# Altium project DAQ_REV_B.PrjPcb
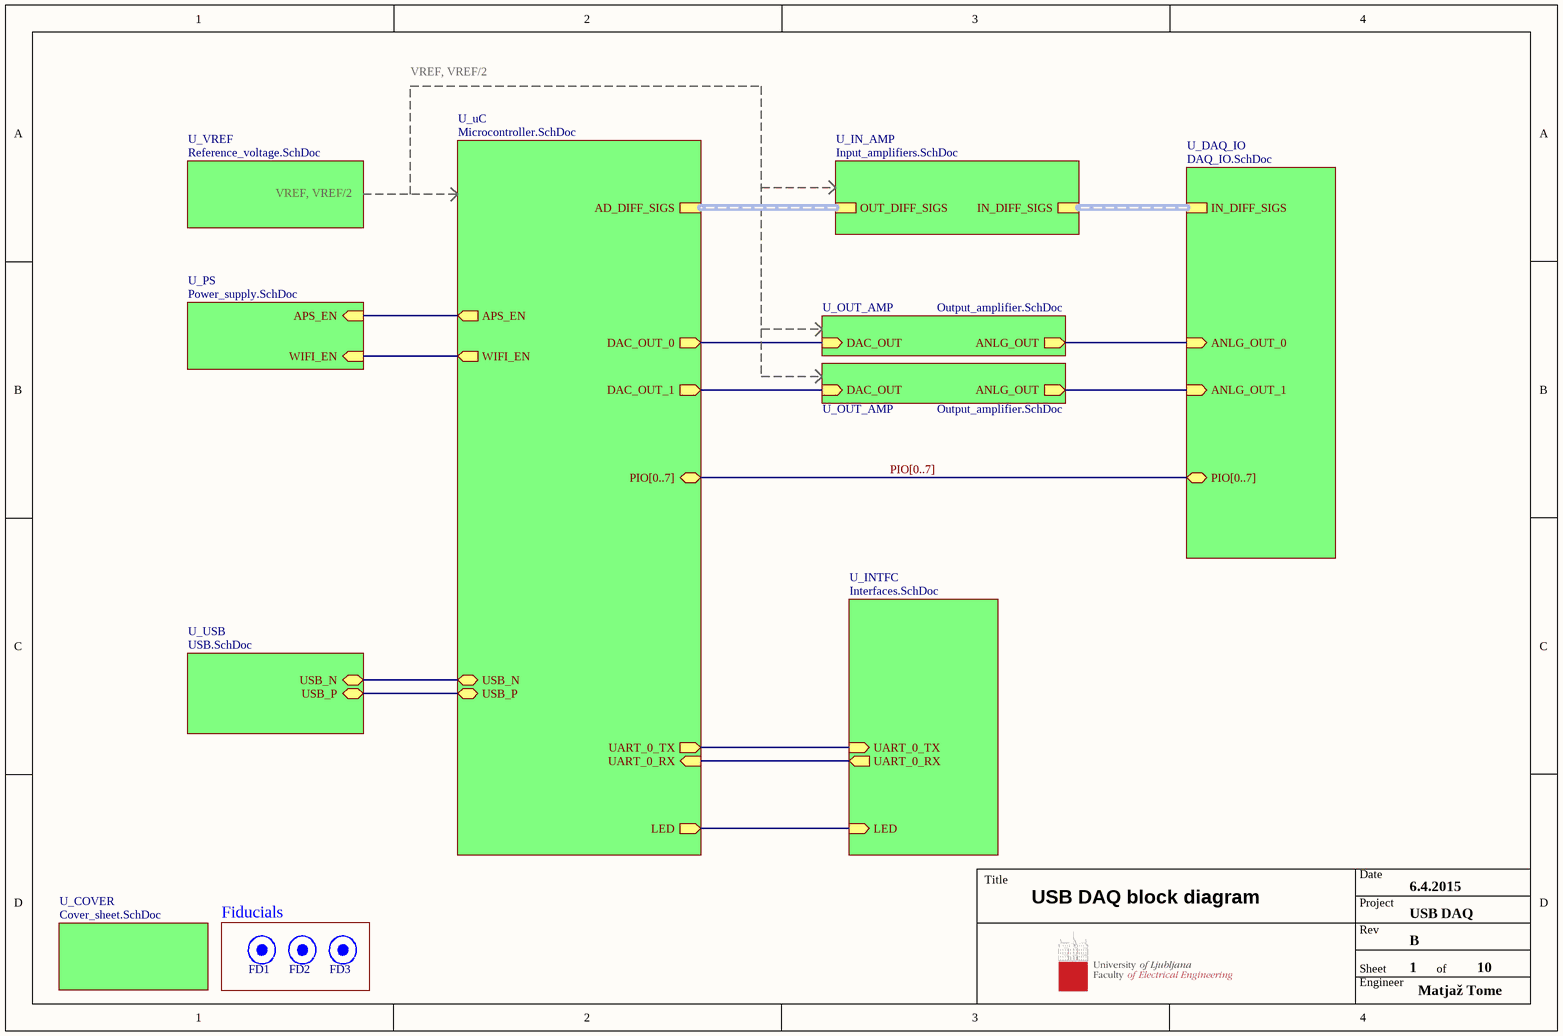
[diagram p0: DAQ_REV_B.SchDoc]
4 sheets, 66 parts. Net scope: hierarchical (ports join the sheet entries above them; power ports are global).
Board file: DAQ_REV_B.PcbDoc
Sheets:
  DAQ_REV_B.SchDoc
    U_uC = Microcontroller.SchDoc
    U_INTFC = Interfaces.SchDoc
    U_IN_AMP = Input_amplifiers.SchDoc

## Sheet DAQ_REV_B.SchDoc: USB DAQ block diagram
size A4; Date: 6.4.2015; Engineer: Matjaž Tome; DocumentNumber: 1; Revision: B; SheetNumber: 1; SheetTotal: 10; Project: USB DAQ

### Parts
FD1  Fiducial 1mm  [FID1]  (value not drawn)  (no BOM)
FD2  Fiducial 1mm  [FID1]  (value not drawn)  (no BOM)
FD3  Fiducial 1mm  [FID1]  (value not drawn)  (no BOM)

### Blocks framed on the sheet
Fiducials: FD1-FD3

### Sub-sheets
U_COVER = Cover_sheet.SchDoc (file not in this document): no entries
U_DAQ_IO = DAQ_IO.SchDoc (file not in this document): ANLG_OUT_0 (in), ANLG_OUT_1 (in), PIO[0..7] (bidir), IN_DIFF_SIGS (harness Differential signals)
U_IN_AMP = Input_amplifiers.SchDoc: IN_DIFF_SIGS (harness Differential signals), OUT_DIFF_SIGS (harness Differential signals)
U_INTFC = Interfaces.SchDoc: UART_0_TX (in), UART_0_RX (out), LED (in)
U_OUT_AMP = Output_amplifier.SchDoc (file not in this document): ANLG_OUT (out), DAC_OUT (in)
U_OUT_AMP = Output_amplifier.SchDoc (file not in this document): ANLG_OUT (out), DAC_OUT (in)
U_PS = Power_supply.SchDoc (file not in this document): APS_EN (in), WIFI_EN (in)
U_uC = Microcontroller.SchDoc: USB_N (bidir), USB_P (bidir), DAC_OUT_0 (out), DAC_OUT_1 (out), APS_EN (out), UART_0_TX (out), UART_0_RX (in), WIFI_EN (out), LED (out), PIO[0..7] (bidir), AD_DIFF_SIGS (harness Differential signals)
U_USB = USB.SchDoc (file not in this document): USB_N (bidir), USB_P (bidir)
U_VREF = Reference_voltage.SchDoc (file not in this document): no entries

### Nets
APS_EN: sheet U_uC/APS_EN, sheet U_PS/APS_EN
DAC_OUT_0: sheet U_uC/DAC_OUT_0, sheet U_OUT_AMP/DAC_OUT
DAC_OUT_1: sheet U_uC/DAC_OUT_1, sheet U_OUT_AMP/DAC_OUT
JTAG_TDO: sheet U_uC/LED, sheet U_INTFC/LED
UART_0_RX: sheet U_uC/UART_0_RX, sheet U_INTFC/UART_0_RX
UART_0_TX: sheet U_uC/UART_0_TX, sheet U_INTFC/UART_0_TX
USB_N: sheet U_uC/USB_N, sheet U_USB/USB_N
USB_P: sheet U_uC/USB_P, sheet U_USB/USB_P
WIFI_EN: sheet U_uC/WIFI_EN, sheet U_PS/WIFI_EN
(unnamed): sheet U_DAQ_IO/ANLG_OUT_0, sheet U_OUT_AMP/ANLG_OUT
(unnamed): sheet U_DAQ_IO/ANLG_OUT_1, sheet U_OUT_AMP/ANLG_OUT

### Buses and harness runs
bus PIO[0..7] = sheet U_DAQ_IO/PIO[0..7] = sheet U_uC/PIO[0..7]
harness sheet U_DAQ_IO/IN_DIFF_SIGS = sheet U_IN_AMP/IN_DIFF_SIGS
harness sheet U_IN_AMP/OUT_DIFF_SIGS = sheet U_uC/AD_DIFF_SIGS

### Notes on the sheet
- VREF, VREF/2
- Title
- Date
- Project
- Rev
- Engineer
- Sheet
- of

### Library data of the parts
FD1-FD3 = FIDUCIAL: Part Number: XXC0016; Category: Fiducials

## Sheet Microcontroller.SchDoc: Microcontroller
size A4; Date: 6.4.2015; Engineer: Matjaž Tome; DocumentNumber: 4; Revision: B; SheetNumber: 2; SheetTotal: 10; Project: USB DAQ
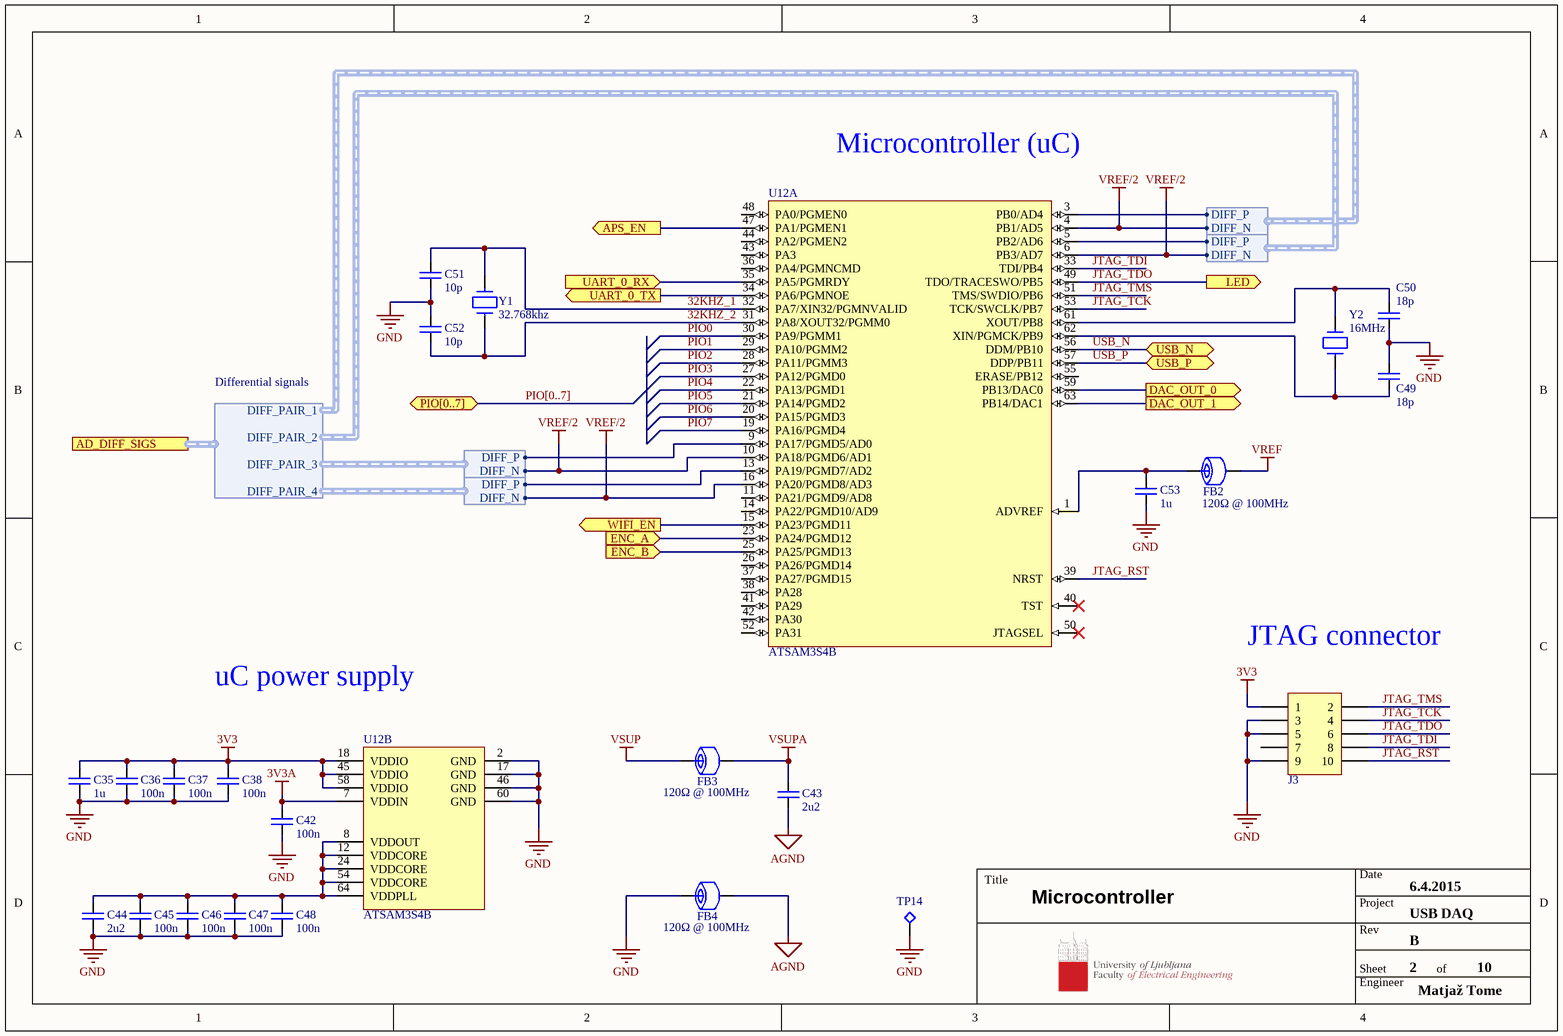
[diagram p1: Microcontroller.SchDoc]

### Parts
C35  value 1u  [C_0603]  (hidden comment: comment)
C36  value 100n  [C_0603]  (hidden comment: comment)
C37  value 100n  [C_0603]  (hidden comment: comment)
C38  value 100n  [C_0603]  (hidden comment: comment)
C42  value 100n  [C_0603]  (hidden comment: comment)
C43  value 2u2  [C_0603]  (hidden comment: comment)
C44  value 2u2  [C_0603]  (hidden comment: comment)
C45  value 100n  [C_0603]  (hidden comment: comment)
C46  value 100n  [C_0603]  (hidden comment: comment)
C47  value 100n  [C_0603]  (hidden comment: comment)
C48  value 100n  [C_0603]  (hidden comment: comment)
C49  value 18p  [C_0603]  (hidden comment: comment)
C50  value 18p  [C_0603]  (hidden comment: comment)
C51  value 10p  [C_0603]  (hidden comment: comment)
C52  value 10p  [C_0603]  (hidden comment: comment)
C53  value 1u  [C_0603]  (hidden comment: comment)
FB2  120Ω @ 100MHz  [SMD_0805]
FB3  120Ω @ 100MHz  [SMD_0805]
FB4  120Ω @ 100MHz  [SMD_0805]
J3  M50-3600542  [HEADER_2X05_1.27mm]  (value not drawn)
TP14  testpoint  [TP1_FULL]  (value not drawn)
U12  ATSAM3S4B  [LQFP64]  (parts A,B of 2)
Y1  32.768khz  [2X6_FLAT]
Y2  16MHz  [5X3.2]

### Ports
AD_DIFF_SIGS (harness Differential signals), APS_EN (out), DAC_OUT_0 (out), DAC_OUT_1 (out), ENC_A (in), ENC_B (in), LED (out), PIO[0..7] (bidir), UART_0_RX (in), UART_0_TX (out), USB_N (bidir), USB_P (bidir), WIFI_EN (out)

### Harnesses
Differential pair: DIFF_P, DIFF_N
Differential signals: DIFF_PAIR_1, DIFF_PAIR_2, DIFF_PAIR_3, DIFF_PAIR_4

### Nets
3V3: C35.1 C36.1 C37.1 C38.1 J3.1 U12.18(VDDIO) U12.45(VDDIO) U12.58(VDDIO)
3V3A: C42.1 U12.7(VDDIN)
AGND: C43.2 FB4.2
GND: C35.2 C36.2 C37.2 C38.2 C42.2 C44.2 C45.2 C46.2 C47.2 C48.2 C49.2 C50.2 C51.2 C52.2 C53.2 FB4.1 J3.3 J3.5 J3.9 TP14.1 U12.2(GND) U12.17(GND) U12.46(GND) U12.60(GND)
VREF: FB2.2
VREF/2: U12.4(PB1/AD5) U12.6(PB3/AD7) U12.10(PA18/PGMD6/AD1) U12.16(PA20/PGMD8/AD3) ; harness Differential pair.DIFF_N
VSUP: FB3.1
VSUPA: C43.1 FB3.2
32KHZ_1: C51.1 U12.32(PA7/XIN32/PGMNVALID) Y1.2
32KHZ_2: C52.1 U12.31(PA8/XOUT32/PGMM0) Y1.1
APS_EN: U12.47(PA1/PGMEN1) ; port APS_EN
DAC_OUT_0: U12.59(PB13/DAC0) ; port DAC_OUT_0
DAC_OUT_1: U12.63(PB14/DAC1) ; port DAC_OUT_1
ENC_A: U12.23(PA24/PGMD12) ; port ENC_A
ENC_B: U12.25(PA25/PGMD13) ; port ENC_B
JTAG_RST: J3.10 U12.39(NRST)
JTAG_TCK: J3.4 U12.53(TCK/SWCLK/PB7)
JTAG_TDI: J3.8 U12.33(TDI/PB4)
JTAG_TDO: J3.6 U12.49(TDO/TRACESWO/PB5) ; port LED
JTAG_TMS: J3.2 U12.51(TMS/SWDIO/PB6)
OUT1_P: U12.3(PB0/AD4) ; harness Differential pair.DIFF_P
OUT2_P: U12.5(PB2/AD6) ; harness Differential pair.DIFF_P
OUT3_P: U12.9(PA17/PGMD5/AD0) ; harness Differential pair.DIFF_P
OUT4_P: U12.13(PA19/PGMD7/AD2) ; harness Differential pair.DIFF_P
PIO0: U12.30(PA9/PGMM1)
PIO1: U12.29(PA10/PGMM2)
PIO2: U12.28(PA11/PGMM3)
PIO3: U12.27(PA12/PGMD0)
PIO4: U12.22(PA13/PGMD1)
PIO5: U12.21(PA14/PGMD2)
PIO6: U12.20(PA15/PGMD3)
PIO7: U12.19(PA16/PGMD4)
UART_0_RX: U12.35(PA5/PGMRDY) ; port UART_0_RX
UART_0_TX: U12.34(PA6/PGMNOE) ; port UART_0_TX
USB_N: U12.56(DDM/PB10) ; port USB_N
USB_P: U12.57(DDP/PB11) ; port USB_P
WIFI_EN: U12.15(PA23/PGMD11) ; port WIFI_EN
NetC44_1: C44.1 C45.1 C46.1 C47.1 C48.1 U12.8(VDDOUT) U12.12(VDDCORE) U12.24(VDDCORE) U12.54(VDDCORE) U12.64(VDDPLL)
NetC49_1: C49.1 U12.62(XIN/PGMCK/PB9) Y2.1
NetC50_1: C50.1 U12.61(XOUT/PB8) Y2.2
NetC53_1: C53.1 FB2.1 U12.1(ADVREF)

Not connected (* = marked no-connect by the designer): J3 7; U12 11(PA21/PGMD9/AD8) 14(PA22/PGMD10/AD9) 26(PA26/PGMD14) 36(PA4/PGMNCMD) 37(PA27/PGMD15) 38(PA28) 40(TST)* 41(PA29) 42(PA30) 43(PA3) 44(PA2/PGMEN2) 48(PA0/PGMEN0) 50(JTAGSEL)* 52(PA31) 55(ERASE/PB12)

### Buses and harness runs
bus PIO[0..7] = port PIO[0..7]

### Notes on the sheet
- Microcontroller (uC)
- JTAG connector
- uC power supply
- Title
- Date
- Project
- Rev
- Engineer
- Sheet
- of

### Library data of the parts
C35-C38 C42-C53 = Capacitor: Generic capacitor
FB2-FB4 = BLM21AG121SN1D: Ferrite Bead, 0805 [2012 Metric], 120 ohm, 800 mA, BLM21A Series, 0.15 ohm, ± 25%; Manufacturer: Murata; Dealer number: 1515617; Dealer: Farnell; DC resistance: 0.15Ω; Max current: 0.2A; Category: ferite beads; Price: 0.082; Manufacturer Number: BLM21AG121SN1D; AC resistance: 120Ω; Frequency: 100MHz; Case: 0805; Technology: SMT; HelpURL: https://www.farnell.com/datasheets/1914683.pdf
J3 = M50-3600542: Pin Header, Board-to-Board, 1.27 mm, 2 Rows, 10 Contacts, Surface Mount, Archer M50 Series; Manufacturer: Harwin; Dealer number: 1022310; Dealer: Farnell; Gender: Male; Rows: 2; Pitch: 1.27mm; Category: Connectors; Price: 0.90; Manufacturer Number: M50-3600542; Pins: 5; Orientation: strait; Technology: SMD; HelpURL: https://cdn.harwin.com/pdfs/M50-360.pdf
TP14 = Test Point: testpoint 1.5mm diameter no hole; Part Number: XXC0006; Category: testpoints
U12 = ATSAM3SXB: Cortex M3 ARM microcontroller; Part Number: XAM0003; Manufacturer: Atmel; Manufacturer Number: ATSAM3S4BA-AU; Dealer number: 1841656; Dealer: Farnell; Core: Cortex-M3; Supply voltage max: 3.6V; Supply voltage min: 1.62V; Flash: 256kB; RAM: 48kB; GPIOs: 47; Timers: 3; ADCs: 8; SPI: 1; IIC: 2; Max Frequency: 64MHz; Category: Integrated circuits; Price: 6.58; UART: 3; Case: LQFP64; Technology: SMT; HelpURL: https://www.farnell.com/datasheets/1698183.pdf; Temperature range: -40°C to +85°C
Y1 = R26-32.768- 12.5: Crystal, 32.768 kHz, Cylinder Radial, 6.2mm x 2mm Dia, 12.5 pF, 20 ppm, R26 Series; Part Number: XCR0010; Manufacturer: RALTRON; Dealer number: 1652573; Dealer: Farnell; Value: 32.758khz; Load capacitance: 12pF; Frequency tolerance: 20ppm; Category: Crystals; Price: 0.18; Manufacturer Number: R26-32.768- 12.5; Technology: THT; Case: 5X3.2_1; HelpURL: http://www.ramitechnology.com/products/spec/crystal/crystal-r38_26_145.pdf
Y2 = 7A-16.000MAAJ-T: Crystal, 16 MHz, SMD, 5mm x 3.2mm, 30 ppm, 18 pF, 30 ppm, 7A Series; Manufacturer: TCX; Dealer number: 1841946; Dealer: Farnell; Load capacitance: 18pF; Frequency tolerance: 30ppm; Category: Crystals; Price: 0.91; Manufacturer Number: 7A-16.000MAAJ-T; Value: 16MHz; Technology: SMT; Case: 5X3.2; HelpURL: https://www.farnell.com/datasheets/1041607.pdf

## Sheet Interfaces.SchDoc: Interfaces
size A4; Date: 6.4.2015; Engineer: Matjaž Tome; DocumentNumber: 7; Revision: B; SheetNumber: 5; SheetTotal: 10; Project: USB DAQ
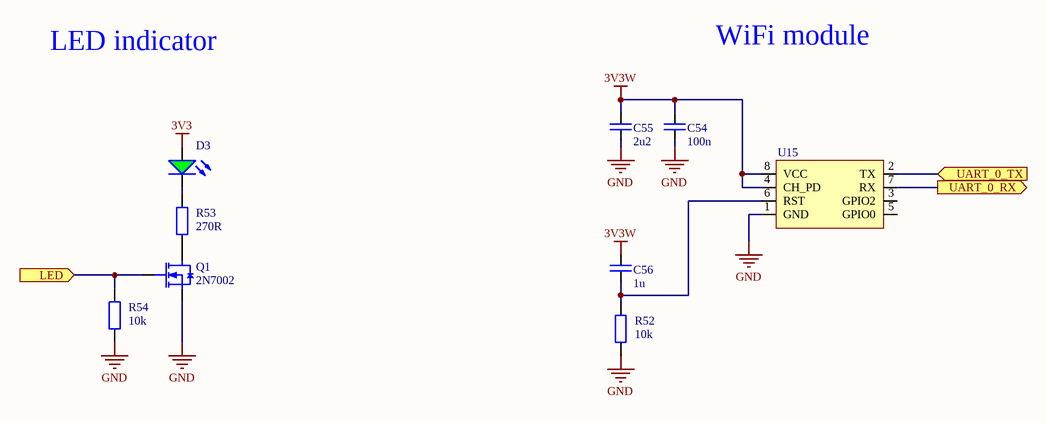
[diagram p2: Interfaces.SchDoc]

### Parts
C54  100n  [C_0603]
C55  2u2  [C_0603]
C56  1u  [C_0603]
D3  LED Green  [LED_0603]  (value not drawn)
Q1  2N7002  [SOT23-3]
R52  value 10k  [R_0603]  (hidden comment: comment)
R53  value 270R  [R_0603]  (hidden comment: comment)
R54  value 10k  [R_0603]  (hidden comment: comment)
U15  ESP-01  [ESP-01]  (value not drawn)

### Ports
LED (in), UART_0_RX (out), UART_0_TX (in)

### Nets
3V3: D3.2(+)
3V3W: C54.2 C55.2 C56.2 U15.4(CH_PD) U15.8(VCC)
GND: C54.1 C55.1 Q1.2(S) R52.1 R54.1 U15.1(GND)
JTAG_TDO: Q1.1(G) R54.2 ; port LED
UART_0_RX: U15.7(RX) ; port UART_0_RX
UART_0_TX: U15.2(TX) ; port UART_0_TX
NetC56_1: C56.1 R52.2 U15.6(RST)
NetD3_1: D3.1(-) R53.2
NetQ1_3: Q1.3(D) R53.1

Not connected (* = marked no-connect by the designer): U15 3(GPIO2) 5(GPIO0)

### Notes on the sheet
- LED indicator
- WiFi module
- Title
- Date
- Project
- Rev
- Engineer
- Sheet
- of

### Library data of the parts
C54-C56 = Capacitor: Generic capacitor
  C54: Value: 100n
  C55: Value: 2u2
  C56: Value: 1u
D3 = LED Green: Generic LED Green
Q1 = 2N7002: 60V 0.3A N-channel MOSFET; Part Number: XMN0002; Manufacturer: NXP; Dealer number: 1510761; Dealer: Farnell; RDS: 2.8Ω; Max power disipation: 830mW; Type: N-enhancment mode; Logic level: Yes; Category: mosfets; Price: 0.039; Manufacturer Number: 2N7002; Max voltage: 60V; Max current: 0.3A; Case: SOT23-3; Technology: SMT; HelpURL: https://www.farnell.com/datasheets/1499179.pdf; SKU: 5000000000001
R52-R54 = Resistor: Generic resistor
U15 = ESP-01: WIFI module; Part Number: XWM0000; Dealer: Ebay; Category: WIFI modules; Price: 3.8; Technology: THT; HelpURL: https://en.wikipedia.org/wiki/ESP8266

## Sheet Input_amplifiers.SchDoc: Input signal amplifiers
size A4; Date: 6.4.2015; Engineer: Matjaž Tome; Revision: B; SheetNumber: 7; SheetTotal: 10; Project: USB DAQ
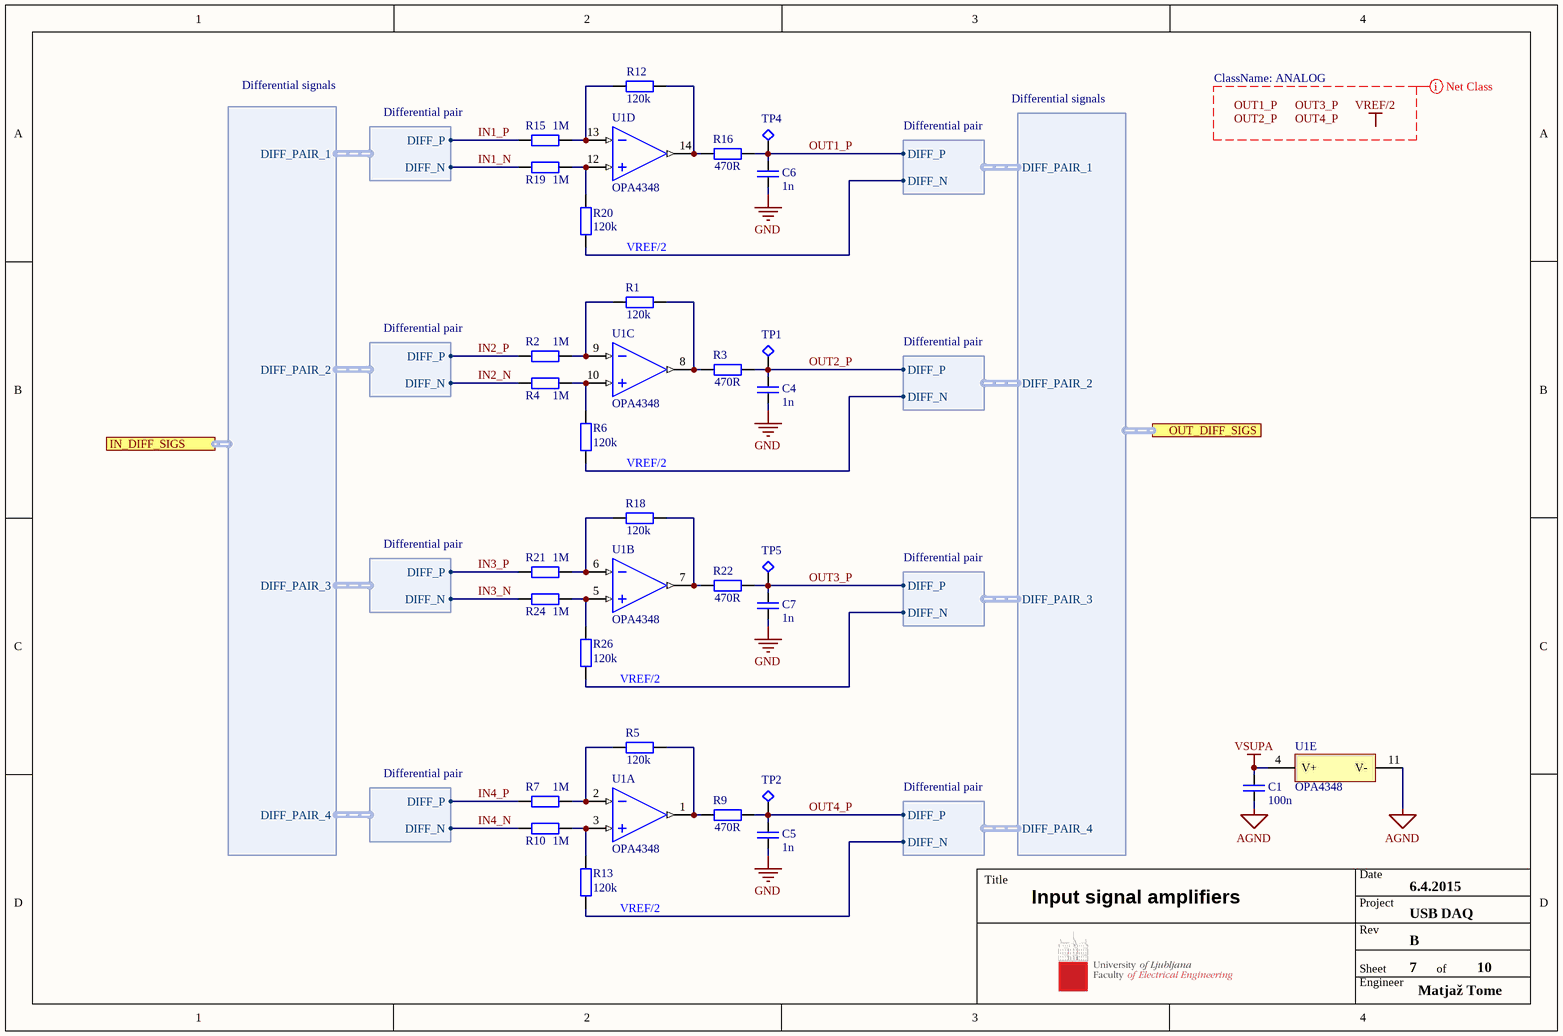
[diagram p3: Input_amplifiers.SchDoc]

### Parts
C1  value 100n  [C_0603]  (hidden comment: comment)
C4  value 1n  [C_0603]  (hidden comment: comment)
C5  value 1n  [C_0603]  (hidden comment: comment)
C6  value 1n  [C_0603]  (hidden comment: comment)
C7  value 1n  [C_0603]  (hidden comment: comment)
R1  value 120k  [R_0603]  (hidden comment: comment)
R2  value 1M  [R_0603]  (hidden comment: comment)
R3  value 470R  [R_0603]  (hidden comment: comment)
R4  value 1M  [R_0603]  (hidden comment: comment)
R5  value 120k  [R_0603]  (hidden comment: comment)
R6  value 120k  [R_0603]  (hidden comment: comment)
R7  value 1M  [R_0603]  (hidden comment: comment)
R9  value 470R  [R_0603]  (hidden comment: comment)
R10  value 1M  [R_0603]  (hidden comment: comment)
R12  value 120k  [R_0603]  (hidden comment: comment)
R13  value 120k  [R_0603]  (hidden comment: comment)
R15  value 1M  [R_0603]  (hidden comment: comment)
R16  value 470R  [R_0603]  (hidden comment: comment)
R18  value 120k  [R_0603]  (hidden comment: comment)
R19  value 1M  [R_0603]  (hidden comment: comment)
R20  value 120k  [R_0603]  (hidden comment: comment)
R21  value 1M  [R_0603]  (hidden comment: comment)
R22  value 470R  [R_0603]  (hidden comment: comment)
R24  value 1M  [R_0603]  (hidden comment: comment)
R26  value 120k  [R_0603]  (hidden comment: comment)
TP1  testpoint  [TP1_FULL]  (value not drawn)
TP2  testpoint  [TP1_FULL]  (value not drawn)
TP4  testpoint  [TP1_FULL]  (value not drawn)
TP5  testpoint  [TP1_FULL]  (value not drawn)
U1  OPA4348  [SOIC14]  (parts A,B,C,D,E of 5)

### Ports
IN_DIFF_SIGS (harness Differential signals), OUT_DIFF_SIGS (harness Differential signals)

### Harnesses
Differential signals: DIFF_PAIR_1, DIFF_PAIR_2, DIFF_PAIR_3, DIFF_PAIR_4
Differential pair: DIFF_P, DIFF_N

### Nets
AGND: C1.1 U1.11(V-)
GND: C4.2 C5.2 C6.2 C7.2
VREF/2: R6.1 R13.1 R20.1 R26.1 ; harness Differential pair.DIFF_N
VSUPA: C1.2 U1.4(V+)
IN1_N: R19.1 ; harness Differential pair.DIFF_N
IN1_P: R15.1 ; harness Differential pair.DIFF_P
IN2_N: R4.1 ; harness Differential pair.DIFF_N
IN2_P: R2.1 ; harness Differential pair.DIFF_P
IN3_N: R24.1 ; harness Differential pair.DIFF_N
IN3_P: R21.1 ; harness Differential pair.DIFF_P
IN4_N: R10.1 ; harness Differential pair.DIFF_N
IN4_P: R7.1 ; harness Differential pair.DIFF_P
OUT1_P: C6.1 R16.2 TP4.1 ; harness Differential pair.DIFF_P
OUT2_P: C4.1 R3.2 TP1.1 ; harness Differential pair.DIFF_P
OUT3_P: C7.1 R22.2 TP5.1 ; harness Differential pair.DIFF_P
OUT4_P: C5.1 R9.2 TP2.1 ; harness Differential pair.DIFF_P
NetR1_1: R1.1 R2.2 U1.9(-IN_C)
NetR1_2: R1.2 R3.1 U1.8(OUT_C)
NetR4_2: R4.2 R6.2 U1.10(+IN_C)
NetR5_1: R5.1 R7.2 U1.2(-IN_A)
NetR5_2: R5.2 R9.1 U1.1(OUT_A)
NetR10_2: R10.2 R13.2 U1.3(+IN_A)
NetR12_1: R12.1 R15.2 U1.13(-IN_D)
NetR12_2: R12.2 R16.1 U1.14(OUT_D)
NetR18_1: R18.1 R21.2 U1.6(-IN_B)
NetR18_2: R18.2 R22.1 U1.7(OUT_B)
NetR19_2: R19.2 R20.2 U1.12(+IN_D)
NetR24_2: R24.2 R26.2 U1.5(+IN_B)

### Layout directives
net class ANALOG: OUT1_P, OUT2_P, OUT3_P, OUT4_P, VREF/2

### Notes on the sheet
- VREF/2
- (near R26) VREF/2
- (near R13) VREF/2
- Labels drawn without touching a wire or pin: OUT1_P, OUT2_P, OUT3_P, OUT4_P, VREF/2
- Title
- Date
- Project
- Rev
- Engineer
- Sheet
- of

### Library data of the parts
C1 C4-C7 = Capacitor: Generic capacitor
R1-R7 R9 R10 R12 R13 R15 R16 R18-R22 R24 R26 = Resistor: Generic resistor
TP1 TP2 TP4 TP5 = Test Point: as TP14 on sheet Microcontroller; Category: testpoints
U1 = OPA4348: 1MHz, 45µA, CMOS, Rail-to-Rail OPERATIONAL AMPLIFIERS Value Line Series; Part Number: XOG0008; Manufacturer: Texas Instruments; Manufacturer Number: OPA4348AID; Dealer number: 2323277; Dealer: Farnell; Supply voltage max: 5.5V; Supply voltage min: 2.1V; Devices: 4; Rail to Rail: IN/OUT; Category: Integrated circuits; Price: 1.64; GBP: 1MHz; Case: SOIC14; Technology: SMT; HelpURL: http://www.ti.com/general/docs/suppproductinfo.tsp?distId=26&gotoUrl=http%3A%2F%2Fwww.ti.com%2Flit%2Fgpn%2Fopa4348

## Nets that join several sheets
3V3: Microcontroller (8 pins), Interfaces (D3.2)
AGND: Microcontroller (C43.2 FB4.2), Input_amplifiers (C1.1 U1.11)
GND: Microcontroller (24 pins), Interfaces (6 pins), Input_amplifiers (C4.2 C5.2 C6.2 C7.2)
VREF/2: Microcontroller (U12.4 U12.6 U12.10 U12.16), Input_amplifiers (R6.1 R13.1 R20.1 R26.1)
VSUPA: Microcontroller (C43.1 FB3.2), Input_amplifiers (C1.2 U1.4)
JTAG_TDO: Microcontroller (J3.6 U12.49), Interfaces (Q1.1 R54.2)
OUT1_P: Microcontroller (U12.3), Input_amplifiers (C6.1 R16.2 TP4.1)
OUT2_P: Microcontroller (U12.5), Input_amplifiers (C4.1 R3.2 TP1.1)
OUT3_P: Microcontroller (U12.9), Input_amplifiers (C7.1 R22.2 TP5.1)
OUT4_P: Microcontroller (U12.13), Input_amplifiers (C5.1 R9.2 TP2.1)
UART_0_RX: Microcontroller (U12.35), Interfaces (U15.7)
UART_0_TX: Microcontroller (U12.34), Interfaces (U15.2)